# Altium project apt_battery_bms.PrjPCB (part 3 of 4)

## Sheet control_and_gauge.SchDoc
size Tabloid
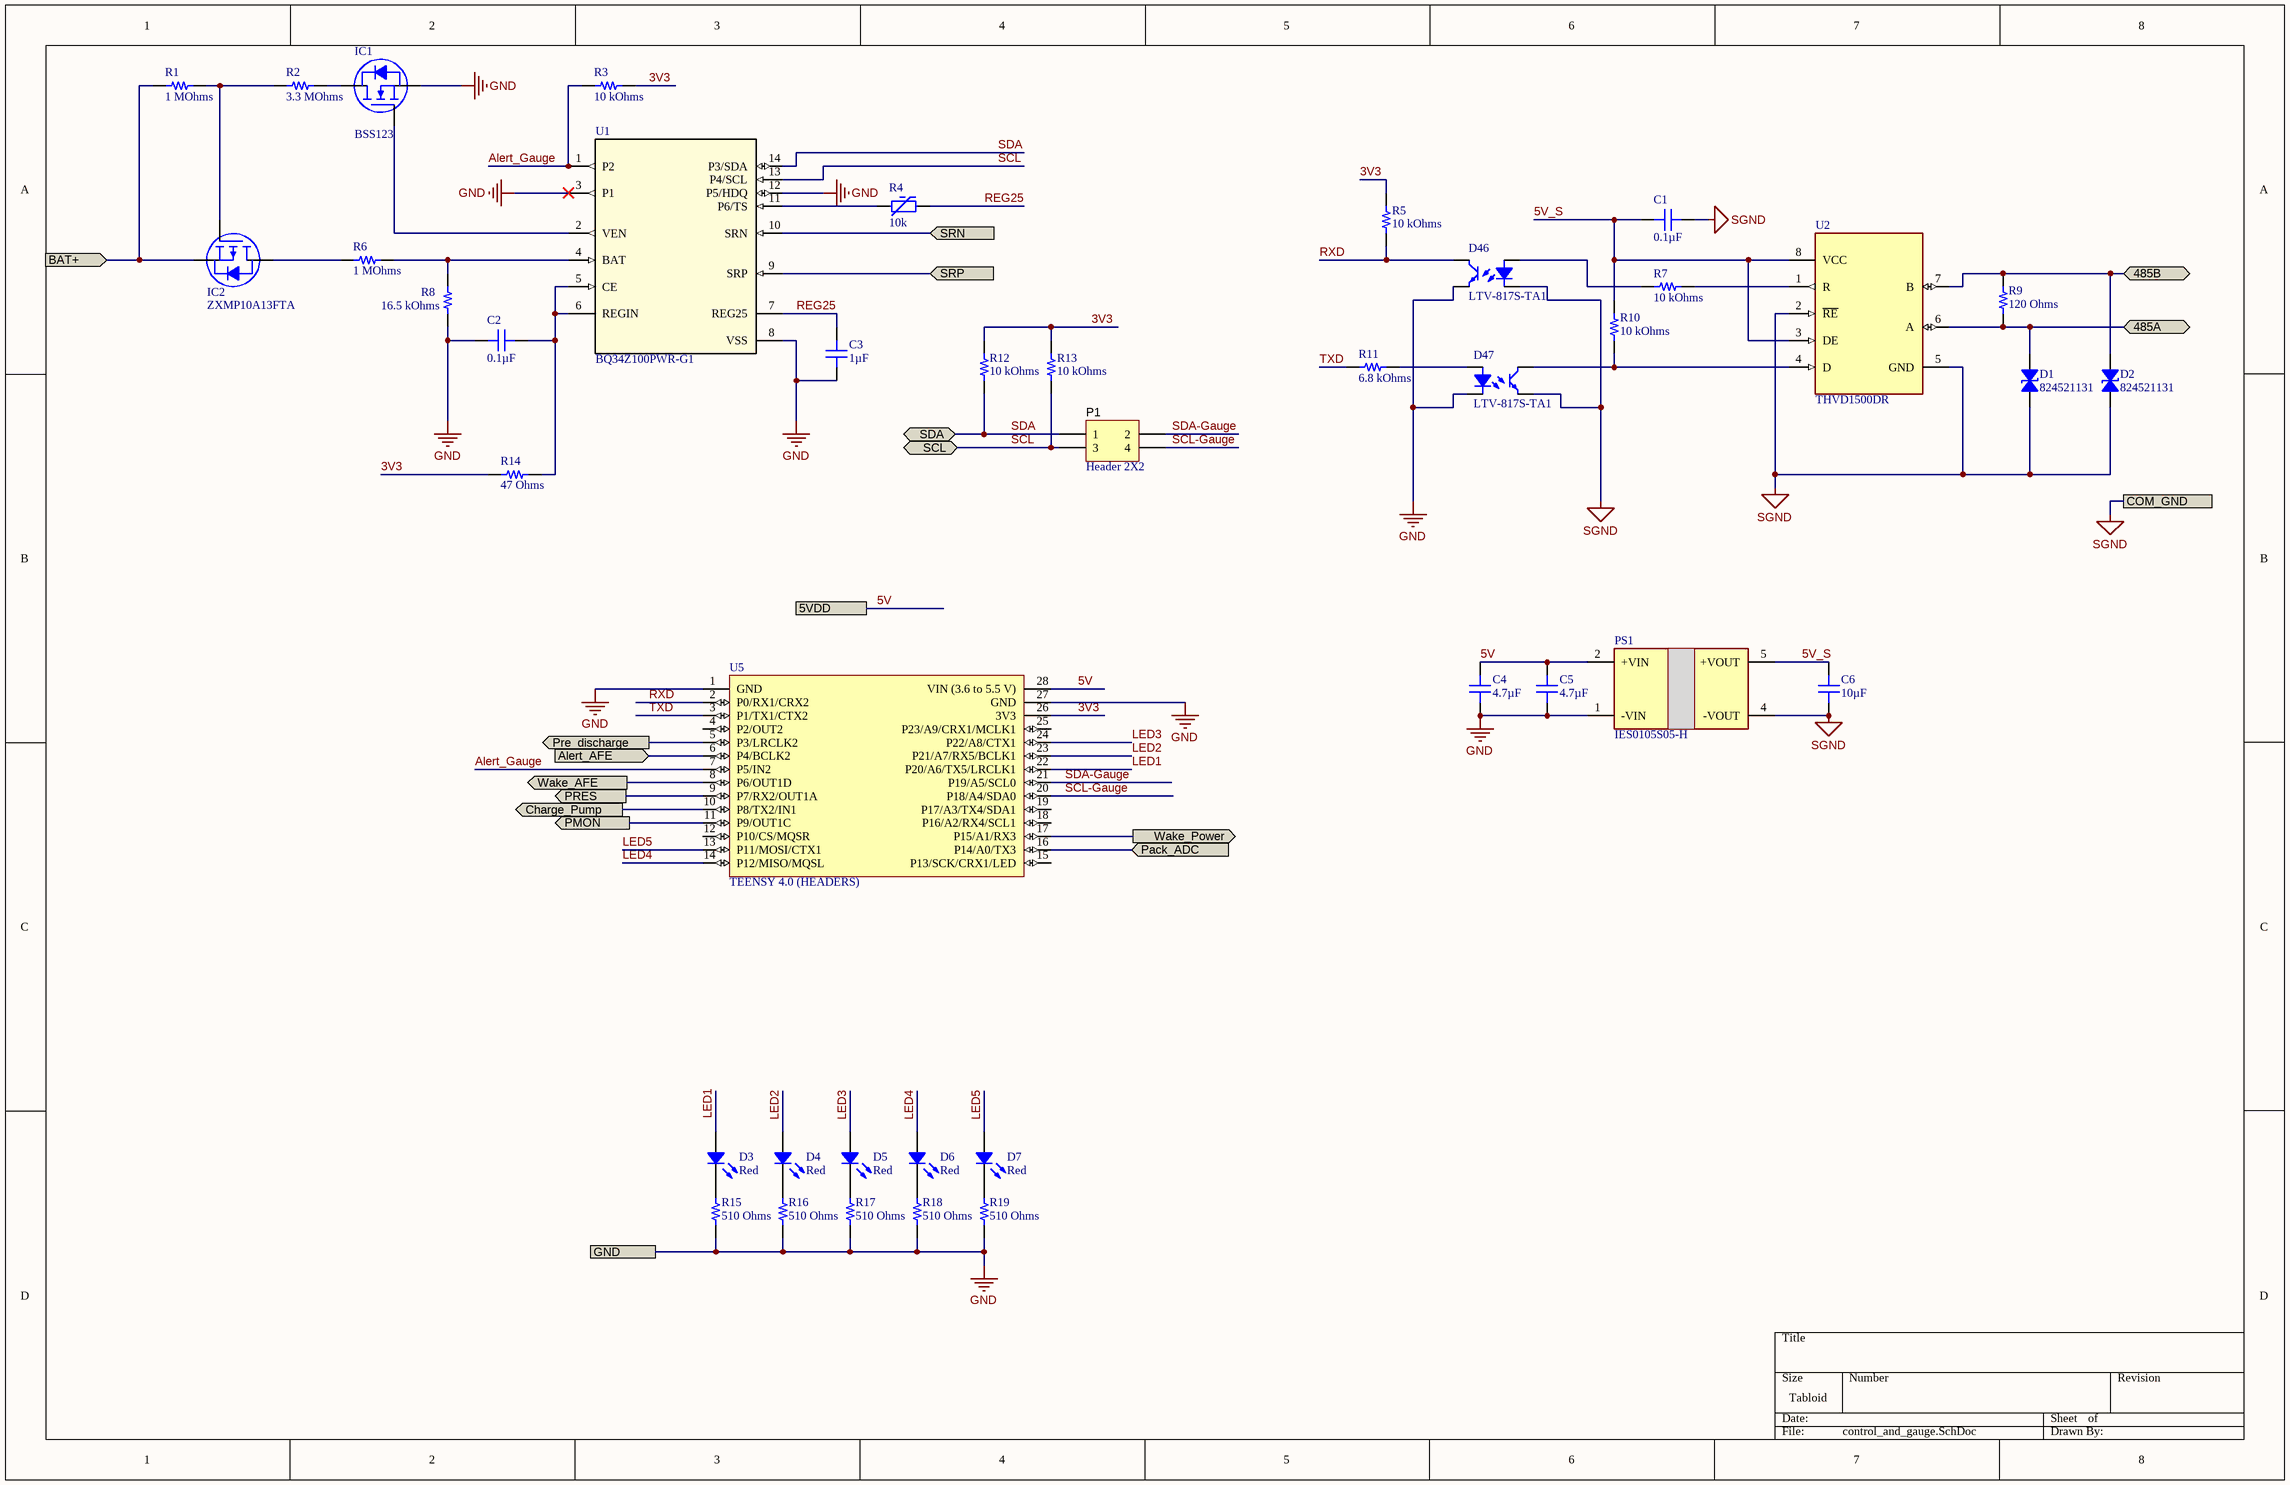
[diagram p2: control_and_gauge.SchDoc]

### Parts
C1  0.1µF  [CAP 0603_1608]
C2  0.1µF  [CAP 0603_1608]
C3  1µF  [CAP 0603_1608]
C4  4.7µF  [CAP 0805_2012]
C5  4.7µF  [CAP 0805_2012]
C6  10µF  [CAP 1210_3225 - 2.8MM]
D1  824521131  [DO214AA SMB]
D2  824521131  [DO214AA SMB]
D3  Red  [LED 0603_1608 RED]
D4  Red  [LED 0603_1608 RED]
D5  Red  [LED 0603_1608 RED]
D6  Red  [LED 0603_1608 RED]
D7  Red  [LED 0603_1608 RED]
D46  LTV-817S-TA1  [LITEON LTV-817]
D47  LTV-817S-TA1  [LITEON LTV-817]
IC1  BSS123  [ON SEMI SOT-23-3]
IC2  ZXMP10A13FTA  [DIODES SOT-23-3]
P1  Header 2X2  [HDR2X2]
PS1  IES0105S05-H  [IES0105S05H]
R1  1 MOhms  [RES 0603_1608]
R2  3.3 MOhms  [RES 0603_1608]
R3  10 kOhms  [RES 0603_1608]
R4  10k  [NTC 0603_1608]
R5  10 kOhms  [RES 0603_1608]
R6  1 MOhms  [RES 0603_1608]
R7  10 kOhms  [RES 0603_1608]
R8  16.5 kOhms  [RES 0603_1608]
R9  120 Ohms  [RES 0603_1608]
R10  10 kOhms  [RES 0603_1608]
R11  6.8 kOhms  [RES 0603_1608]
R12  10 kOhms  [RES 0603_1608]
R13  10 kOhms  [RES 0603_1608]
R14  47 Ohms  [RES 0603_1608]
R15  510 Ohms  [RES 0603_1608]
R16  510 Ohms  [RES 0603_1608]
R17  510 Ohms  [RES 0603_1608]
R18  510 Ohms  [RES 0603_1608]
R19  510 Ohms  [RES 0603_1608]
U1  BQ34Z100PWR-G1  [TSSOP_14]
U2  THVD1500DR  [SOIC_8]
U5  TEENSY 4.0 (HEADERS)  [TEENSY_SLIM]

### Ports
5VDD, 485A (bidir), 485B (bidir), Alert_AFE (in), BAT+ (in), Charge_Pump (out), COM_GND, GND, Pack_ADC (in), PMON (out), Pre_discharge (out), PRES (out), SCL (bidir), SDA (bidir), SRN (in), SRP (in), Wake_AFE (out), Wake_Power (out)

### Nets
GND: C2.1 C3.1 C4.1 C5.1 D46.3 D47.2 IC1.2(S) PS1.1(-VIN) R8.1 R15.1 R16.1 R17.1 R18.1 R19.1 U1.3(P1) U1.8(VSS) U1.12(P5/HDQ) U5.1(GND) U5.27(GND) ; port GND  [project net BAT-]
SGND: C1.1 C6.1 D1.1 D2.1 D46.2 D47.3 PS1.4(-VOUT) U2.2(~{RE}) U2.5(GND) ; port COM_GND
3V3: R3.1 R5.2 R12.1 R13.1 R14.1 U5.26(3V3)
5V: C4.2 C5.2 PS1.2(+VIN) U5.28(VIN_(3.6_to_5.5_V)) ; port 5VDD
5V_S: C1.2 C6.2 PS1.5(+VOUT) R10.2 U2.3(DE) U2.8(VCC)
430_Power: IC2.2(S) R1.2 U5.17(P15/A1/RX3) ; port BAT+, port Wake_Power
Alert_Gauge: R3.2 U1.1(P2) U5.7(P5/IN2)
LED1: D3.1 U5.22(P20/A6/TX5/LRCLK1)
LED2: D4.1 U5.23(P21/A7/RX5/BCLK1)
LED3: D5.1 U5.24(P22/A8/CTX1)
LED4: D6.1 U5.14(P12/MISO/MQSL)
LED5: D7.1 U5.13(P11/MOSI/CTX1)
REG25: C3.2 R4.1 U1.7(REG25)
RXD: D46.4 R5.1 U5.2(P0/RX1/CRX2)
SCL: P1.3 R13.2 U1.13(P4/SCL) ; port SCL
SCL-Gauge: P1.4 U5.20(P18/A4/SDA0)
SDA: P1.1 R12.2 U1.14(P3/SDA) ; port SDA
SDA-Gauge: P1.2 U5.21(P19/A5/SCL0)
TXD: R11.1 U5.3(P1/TX1/CTX2)
NetC2_2: C2.2 R14.2 U1.5(CE) U1.6(REGIN)
NetC10_2: U5.16(P14/A0/TX3) ; port Pack_ADC
NetC19_2: U5.6(P4/BCLK2) ; port Alert_AFE
NetC52_2: U1.9(SRP) ; port SRP
NetC53_2: U1.10(SRN) ; port SRN
NetD1_2: D1.2 R9.1 U2.6(A) ; port 485A
NetD2_2: D2.2 R9.2 U2.7(B) ; port 485B
NetD3_2: D3.2 R15.2
NetD4_2: D4.2 R16.2
NetD5_2: D5.2 R17.2
NetD6_2: D6.2 R18.2
NetD7_2: D7.2 R19.2
NetD46_1: D46.1 R7.2
NetD47_1: D47.1 R11.2
NetD47_4: D47.4 R10.1 U2.4(D)
NetIC1_1: IC1.1(G) U1.2(VEN)
NetIC1_3: IC1.3(D) R2.2
NetIC2_1: IC2.1(G) R1.1 R2.1
NetIC2_3: IC2.3(D) R6.2
NetIC5_1: U5.5(P3/LRCLK2) ; port Pre_discharge
NetP7_1: U5.9(P7/RX2/OUT1A) ; port PRES
NetR4_2: R4.2 U1.11(P6/TS)
NetR6_1: R6.1 R8.2 U1.4(BAT)
NetR7_1: R7.1 U2.1(R)
NetR29_1: U5.10(P8/TX2/IN1) ; port Charge_Pump
NetR35_1: U5.11(P9/OUT1C) ; port PMON
NetR109_2: U5.8(P6/OUT1D) ; port Wake_AFE

Not connected (* = marked no-connect by the designer): U5 4(P2/OUT2) 12(P10/CS/MQSR) 15(P13/SCK/CRX1/LED) 18(P16/A2/RX4/SCL1) 19(P17/A3/TX4/SDA1) 25(P23/A9/CRX1/MCLK1)

### Library data of the parts
C1 C2 = GCJ188R71H104KA12D: CAP CER 0.1UF 50V X7R 0603; Manufacturer: Murata Electronics; Tolerance: ±10%; Part Number: GCJ188R71H104KA12D; Value: 0.1µF; Applications: Automotive, Boardflex Sensitive; Capacitance: 0.1µF; ComponentLink1Description: Datasheet; ComponentLink1URL: https://www.murata.com/~/media/webrenewal/support/library/catalog/products/capacitor/mlcc/c03e.ashx?la=en-us; ComponentLink2Description: DigiKey Link; ComponentLink2URL: http://digikey.com/product-detail/en/murata-electronics/GCJ188R71H104KA12D/490-5798-1-ND/2783823; Device Package: 0603 (1608 Metric); Features: Soft Termination; LastUpdated: 9/2/2020 1:03:05 AM; Lifecycle Status: Active; Minimum Order: 1; Mounting Type: Surface Mount, MLCC; Operating Temperature: -55°C ~ 125°C; Package / Case: 0603 (1608 Metric); Packaging: TapeAndReel; PartId: 16867; Part Status: Active; Price: 0.02; Ratings: AEC-Q200; Series: GCJ; Size / Dimension: 0.063" L x 0.031" W (1.60mm x 0.80mm); Supplier 1: DigiKey; Supplier Part Number 1: 490-5798-1-ND; Temperature Coefficient: X7R; Thickness (Max): 0.035" (0.90mm); Voltage - Rated: 50V
C3 = CGA3E3X5R1H105K080AB: CAP CER 1UF 50V X5R 0603; Manufacturer: TDK Corporation; Tolerance: ±10%; Part Number: CGA3E3X5R1H105K080AB; Value: 1µF; Applications: Automotive; Capacitance: 1µF; ComponentLink1Description: Datasheet; ComponentLink1URL: https://product.tdk.com/info/en/catalog/datasheets/mlcc_automotive_general_en.pdf?ref_disty=digikey; ComponentLink2Description: DigiKey Link; ComponentLink2URL: http://digikey.com/product-detail/en/tdk-corporation/CGA3E3X5R1H105K080AB/445-7878-1-ND/2781382; Device Package: 0603 (1608 Metric); LastUpdated: 9/2/2020 1:03:17 AM; Lifecycle Status: Active; Minimum Order: 1; Mounting Type: Surface Mount, MLCC; Operating Temperature: -55°C ~ 85°C; Package / Case: 0603 (1608 Metric); Packaging: TapeAndReel; PartId: 12841; Part Status: Active; Price: 0.05; Ratings: AEC-Q200; Series: CGA; Size / Dimension: 0.063" L x 0.031" W (1.60mm x 0.80mm); Supplier 1: DigiKey; Supplier Part Number 1: 445-7878-1-ND; Temperature Coefficient: X5R; Thickness (Max): 0.035" (0.90mm); Voltage - Rated: 50V
C4 C5 = CC0805KKX7R7BB475: CAP CER 4.7UF 16V X7R 0805; Manufacturer: Yageo; Tolerance: ±10%; Part Number: CC0805KKX7R7BB475; Value: 4.7µF; Applications: General Purpose; Capacitance: 4.7µF; ComponentLink1Description: Datasheet; ComponentLink1URL: https://www.yageo.com/upload/media/product/productsearch/datasheet/mlcc/UPY-GPHC_X7R_6.3V-to-50V_18.pdf; ComponentLink2Description: DigiKey Link; ComponentLink2URL: http://digikey.com/product-detail/en/yageo/CC0805KKX7R7BB475/311-1883-1-ND/5195785; Device Package: 0805 (2012 Metric); LastUpdated: 9/2/2020 1:04:23 AM; Lifecycle Status: Active; Minimum Order: 1; Mounting Type: Surface Mount, MLCC; Operating Temperature: -55°C ~ 125°C; Package / Case: 0805 (2012 Metric); Packaging: TapeAndReel; PartId: 12987; Part Status: Active; Price: 0.09; Series: CC; Size / Dimension: 0.079" L x 0.049" W (2.00mm x 1.25mm); Supplier 1: DigiKey; Supplier Part Number 1: 311-1883-1-ND; Temperature Coefficient: X7R; Thickness (Max): 0.057" (1.45mm); Voltage - Rated: 16V
C6 = C3225X5R1H106K250AB: CAP CER 10UF 50V X5R 1210; Manufacturer: TDK Corporation; Tolerance: ±10%; Part Number: C3225X5R1H106K250AB; Value: 10µF; Applications: General Purpose; Capacitance: 10µF; ComponentLink1Description: Datasheet; ComponentLink1URL: https://product.tdk.com/info/en/catalog/datasheets/mlcc_commercial_general_en.pdf?ref_disty=digikey; ComponentLink2Description: DigiKey Link; ComponentLink2URL: http://digikey.com/product-detail/en/tdk-corporation/C3225X5R1H106K250AB/445-9074-1-ND/3648647; Device Package: 1210 (3225 Metric); Features: Low ESL; LastUpdated: 9/2/2020 1:10:51 AM; Lifecycle Status: Active; Minimum Order: 1; Mounting Type: Surface Mount, MLCC; Operating Temperature: -55°C ~ 85°C; Package / Case: 1210 (3225 Metric); Packaging: TapeAndReel; PartId: 23834; Part Status: Active; Price: 0.34; Series: C; Size / Dimension: 0.126" L x 0.098" W (3.20mm x 2.50mm); Supplier 1: DigiKey; Supplier Part Number 1: 445-9074-1-ND; Temperature Coefficient: X5R; Thickness (Max): 0.110" (2.80mm); Voltage - Rated: 50V
D1 D2 = 824521131: TVS DIODE 13V 21.5V DO214AA; Manufacturer: Würth Elektronik; Bidirectional Channels: 1; Current - Peak Pulse (10/1000µs): 28A; Power Line Protection: No; Power - Peak Pulse: 600W; Type: Zener; Voltage - Breakdown (Min): 15.15V (Typ); Voltage - Reverse Standoff (Typ): 13V (Max); Part Number: 824521131; Applications: General Purpose; ComponentLink1Description: Datasheet; ComponentLink1URL: https://katalog.we-online.de/pbs/datasheet/824521131.pdf; ComponentLink2Description: DigiKey Link; ComponentLink2URL: http://digikey.com/product-detail/en/w-rth-elektronik/824521131/732-9740-1-ND/5870894; LastUpdated: 9/2/2020 1:28:20 AM; Lifecycle Status: Active; Minimum Order: 1; Mounting Type: Surface Mount; Operating Temperature: -65°C ~ 150°C (TJ); Package / Case: DO-214AA, SMB; Packaging: TapeAndReel; PartId: 9447; Part Status: Active; Price: 0.24; Series: WE-TVSP; Supplier 1: DigiKey; Supplier Part Number 1: 732-9740-1-ND; Supplier Device Package: DO-214AA; Voltage - Clamping (Max) @ Ipp: 21.5V
D3-D7 = 150060RS75000: LED RED CLEAR 0603 SMD; Manufacturer: Würth Elektronik; Configuration: Standard; Current - Test: 20mA; Lens Color: Colorless; Lens Size: 1.10mm x 0.70mm; Lens Style: Rectangle with Flat Top; Millicandela Rating: 250mcd; Viewing Angle: 140°; Voltage - Forward (Vf) (Typ): 2V; Wavelength - Dominant: 625nm; Wavelength - Peak: 630nm; Part Number: 150060RS75000; Color: Red; ComponentLink1Description: Datasheet; ComponentLink1URL: https://katalog.we-online.de/led/datasheet/150060RS75000.pdf; ComponentLink2Description: DigiKey Link; ComponentLink2URL: http://digikey.com/product-detail/en/w-rth-elektronik/150060RS75000/732-4978-1-ND/4489899; Device Package: 0603 (1608 Metric); Height (Max): 0.80mm; LastUpdated: 9/2/2020 1:20:55 AM; Lens Transparency: Clear; Lifecycle Status: Active; Minimum Order: 1; Mounting Type: Surface Mount; Package / Case: 0603 (1608 Metric); Packaging: TapeAndReel; PartId: 490; Part Status: Active; Price: 0.10; Series: WL-SMCW; Size / Dimension: 1.60mm L x 0.80mm W; Supplier 1: DigiKey; Supplier Part Number 1: 732-4978-1-ND; Supplier Device Package: 0603; Value: Red
D46 D47 = LTV-817S-TA1: OPTOISOLATR 5KV TRANSISTOR 4-SMD; Part Number: LTV-817S-TA1
IC1 = BSS123: MOSFET N-CH 100V 170MA SOT-23; Manufacturer: ON Semiconductor; Current - Continuous Drain (Id) @ 25°C: 170mA (Ta); Drive Voltage (Max Rds On,  Min Rds On): 4.5V, 10V; FET Type: N-Channel; Gate Charge (Qg) (Max) @ Vgs: 2.5nC @ 10V; Input Capacitance (Ciss) (Max) @ Vds: 73pF @ 25V; Power Dissipation (Max): 360mW (Ta); Rds On (Max) @ Id, Vgs: 6Ohm @ 170mA, 10V; Vgs (Max): ±20V; Vgs(th) (Max) @ Id: 2V @ 1mA; Part Number: BSS123; ComponentLink1Description: Datasheet; ComponentLink1URL: https://www.onsemi.com/pub/Collateral/BSS123-D.PDF; ComponentLink2Description: DigiKey Link; ComponentLink2URL: http://digikey.com/product-detail/en/on-semiconductor/BSS123/BSS123NCT-ND/244665; Drain to Source Voltage (Vdss): 100V; LastUpdated: 9/2/2020 1:25:08 AM; Lifecycle Status: Active; Minimum Order: 1; Mounting Type: Surface Mount; Operating Temperature: -55°C ~ 150°C (TJ); Package / Case: TO-236-3, SC-59, SOT-23-3; Packaging: TapeAndReel; Part Status: Active; Price: 0.06; Series: -; Supplier 1: DigiKey; Supplier Part Number 1: BSS123NCT-ND; Supplier Device Package: SOT-23-3; Technology: MOSFET (Metal Oxide)
IC2 = ZXMP10A13FTA: MOSFET P-CH 100V 0.6A SOT23-3; Manufacturer: Diodes Incorporated; Current - Continuous Drain (Id) @ 25°C: 600mA (Ta); Drive Voltage (Max Rds On,  Min Rds On): 6V, 10V; FET Type: P-Channel; Gate Charge (Qg) (Max) @ Vgs: 3.5nC @ 10V; Input Capacitance (Ciss) (Max) @ Vds: 141pF @ 50V; Power Dissipation (Max): 625mW (Ta); Rds On (Max) @ Id, Vgs: 1Ohm @ 600mA, 10V; Vgs (Max): ±20V; Vgs(th) (Max) @ Id: 4V @ 250µA; Part Number: ZXMP10A13FTA; ComponentLink1Description: Datasheet; ComponentLink1URL: https://www.diodes.com/assets/Datasheets/ZXMP10A13F.pdf; ComponentLink2Description: DigiKey Link; ComponentLink2URL: http://digikey.com/product-detail/en/diodes-incorporated/ZXMP10A13FTA/ZXMP10A13FCT-ND/560670; Drain to Source Voltage (Vdss): 100V; LastUpdated: 9/2/2020 1:25:04 AM; Lifecycle Status: Active; Minimum Order: 1; Mounting Type: Surface Mount; Operating Temperature: -55°C ~ 150°C (TJ); Package / Case: TO-236-3, SC-59, SOT-23-3; Packaging: TapeAndReel; Part Status: Active; Price: 0.20; Series: -; Supplier 1: DigiKey; Supplier Part Number 1: ZXMP10A13FCT-ND; Supplier Device Package: SOT-23-3; Technology: MOSFET (Metal Oxide)
P1 = Header 2X2: Header, 2-Pin, Dual row; LatestRevisionDate: 17-Jul-2002; LatestRevisionNote: Re-released for DXP Platform.; Publisher: Altium Limited
PS1 = IES0105S05-H: Isolated DC/DC Converters DC-DC, 1W, Unregulated, SMD, HIGH ISOLATION; Manufacturer: XP Power; Datasheet Link: https://www.mouser.com/datasheet/2/942/SF_IES01-1666999.pdf; Height: 7.35mm; Mouser Part Number: 209-IES0105S05-H; Mouser Price/Stock: https://www.mouser.co.uk/ProductDetail/XP-Power/IES0105S05-H?qs=Cb2nCFKsA8q04%252BaEkllcdA%3D%3D; Supplier 1: Mouser; Manufacturer Part Number: IES0105S05-H; Stock 1: 83; Pricing 1: 1=3.4, 5=3.3, 10=3.2, 25=3.06, 50=3.06, 100=2.85 (USD); Supplier 2: Digi-Key; Stock 2: 150; Pricing 2: 1=3.4, 5=3.298, 10=3.196, 25=3.06, 100=2.856 (USD); ComponentLink1Description: https://www.mouser.com/datasheet/2/942/SF_IES01-1666999.pdf; ComponentLink1URL: https://www.mouser.com/datasheet/2/942/SF_IES01-1666999.pdf; Supplier Part Number 1: 209-IES0105S05-H; Supplier Part Number 2: 1470-IES0105S05-H-ND
R1 R6 = CRCW06031M00FKEA: RES SMD 1M OHM 1% 1/10W 0603; Manufacturer: Vishay Dale; Power (Watts): 0.1W, 1/10W; Temperature Coefficient: ±100ppm/°C; Part Number: CRCW06031M00FKEA; Value: 1 MOhms; ComponentLink1Description: Datasheet; ComponentLink1URL: http://www.vishay.com/docs/20035/dcrcwe3.pdf; ComponentLink2Description: DigiKey Link; ComponentLink2URL: http://digikey.com/product-detail/en/vishay-dale/CRCW06031M00FKEA/541-1.00MHCT-ND/1180152; Composition: Thick Film; Device Package: 0603 (1608 Metric); Features: Automotive AEC-Q200; Height - Seated (Max): 0.020" (0.50mm); LastUpdated: 9/2/2020 1:10:09 AM; Lifecycle Status: Active; Minimum Order: 1; Number of Terminations: 2; Operating Temperature: -55°C ~ 155°C; Package / Case: 0603 (1608 Metric); Packaging: CutTape; PartId: 12567; Part Status: Active; Price: 0.10; Ratings: AEC-Q200; Resistance: 1 MOhms; Series: CRCW; Size / Dimension: 0.061" L x 0.033" W (1.55mm x 0.85mm); Supplier 1: DigiKey; Supplier Part Number 1: 541-1.00MHCT-ND; Supplier Device Package: 0603; Tolerance: ±1%
R2 = CRCW06033M30FKEA: RES SMD 3.3M OHM 1% 1/10W 0603; Manufacturer: Vishay Dale; Power (Watts): 0.1W, 1/10W; Temperature Coefficient: ±100ppm/°C; Part Number: CRCW06033M30FKEA; Value: 3.3 MOhms; ComponentLink1Description: Datasheet; ComponentLink1URL: http://www.vishay.com/docs/20035/dcrcwe3.pdf; ComponentLink2Description: DigiKey Link; ComponentLink2URL: http://digikey.com/product-detail/en/vishay-dale/CRCW06033M30FKEA/541-3.30MHCT-ND/1180209; Composition: Thick Film; Device Package: 0603 (1608 Metric); Features: Automotive AEC-Q200; Height - Seated (Max): 0.020" (0.50mm); LastUpdated: 9/2/2020 1:09:32 AM; Lifecycle Status: Active; Minimum Order: 1; Number of Terminations: 2; Operating Temperature: -55°C ~ 155°C; Package / Case: 0603 (1608 Metric); Packaging: CutTape; PartId: 25411; Part Status: Active; Price: 0.10; Ratings: AEC-Q200; Resistance: 3.3 MOhms; Series: CRCW; Size / Dimension: 0.061" L x 0.033" W (1.55mm x 0.85mm); Supplier 1: DigiKey; Supplier Part Number 1: 541-3.30MHCT-ND; Supplier Device Package: 0603; Tolerance: ±1%
R3 R5 R7 R10 R12 R13 = CRCW060310K0FKEA: RES SMD 10K OHM 1% 1/10W 0603; Manufacturer: Vishay Dale; Power (Watts): 0.1W, 1/10W; Temperature Coefficient: ±100ppm/°C; Part Number: CRCW060310K0FKEA; Value: 10 kOhms; ComponentLink1Description: Datasheet; ComponentLink1URL: http://www.vishay.com/docs/20035/dcrcwe3.pdf; ComponentLink2Description: DigiKey Link; ComponentLink2URL: http://digikey.com/product-detail/en/vishay-dale/CRCW060310K0FKEA/541-10.0KHCT-ND/1179924; Composition: Thick Film; Device Package: 0603 (1608 Metric); Features: Automotive AEC-Q200; Height - Seated (Max): 0.020" (0.50mm); LastUpdated: 9/2/2020 1:09:36 AM; Lifecycle Status: Active; Minimum Order: 1; Number of Terminations: 2; Operating Temperature: -55°C ~ 155°C; Package / Case: 0603 (1608 Metric); Packaging: CutTape; PartId: 24636; Part Status: Active; Price: 0.10; Ratings: AEC-Q200; Resistance: 10 kOhms; Series: CRCW; Size / Dimension: 0.061" L x 0.033" W (1.55mm x 0.85mm); Supplier 1: DigiKey; Supplier Part Number 1: 541-10.0KHCT-ND; Supplier Device Package: 0603; Tolerance: ±1%
R4 = NTCS0603E3103FMT: THERMISTOR NTC 10KOHM 3610K 0603; Manufacturer: Vishay BC Components; B Value Tolerance: ±1%; Power - Max: 125mW; Part Number: NTCS0603E3103FMT; B25/85: 3610K; ComponentLink1Description: Datasheet; ComponentLink1URL: http://www.vishay.com/docs/29056/ntcs0603e3t.pdf; ComponentLink2Description: DigiKey Link; ComponentLink2URL: http://digikey.com/product-detail/en/vishay-bc-components/NTCS0603E3103FMT/BC2472CT-ND/2230853; Device Package: 0603 (1608 Metric); LastUpdated: 9/2/2020 1:22:38 AM; Lifecycle Status: Active; Minimum Order: 1; Mounting Type: Surface Mount; Operating Temperature: -40°C ~ 150°C; Package / Case: 0603 (1608 Metric); Packaging: TapeAndReel; PartId: 450; Part Status: Active; Price: 0.38; Resistance in Ohms @ 25°C: 10k; Resistance Tolerance: ±1%; Series: Automotive, AEC-Q200; Supplier 1: DigiKey; Supplier Part Number 1: BC2472CT-ND; Value: 10k
R8 = CRCW060316K5FKEA: RES SMD 16.5K OHM 1% 1/10W 0603; Manufacturer: Vishay Dale; Power (Watts): 0.1W, 1/10W; Temperature Coefficient: ±100ppm/°C; Part Number: CRCW060316K5FKEA; Value: 16.5 kOhms; ComponentLink1Description: Datasheet; ComponentLink1URL: http://www.vishay.com/docs/20035/dcrcwe3.pdf; ComponentLink2Description: DigiKey Link; ComponentLink2URL: http://digikey.com/product-detail/en/vishay-dale/CRCW060316K5FKEA/541-16.5KHCT-ND/1179947; Composition: Thick Film; Device Package: 0603 (1608 Metric); Features: Automotive AEC-Q200; Height - Seated (Max): 0.020" (0.50mm); LastUpdated: 9/2/2020 1:09:44 AM; Lifecycle Status: Active; Minimum Order: 1; Number of Terminations: 2; Operating Temperature: -55°C ~ 155°C; Package / Case: 0603 (1608 Metric); Packaging: CutTape; PartId: 22960; Part Status: Active; Price: 0.10; Ratings: AEC-Q200; Resistance: 16.5 kOhms; Series: CRCW; Size / Dimension: 0.061" L x 0.033" W (1.55mm x 0.85mm); Supplier 1: DigiKey; Supplier Part Number 1: 541-16.5KHCT-ND; Supplier Device Package: 0603; Tolerance: ±1%
R9 = CRCW0603120RFKEA: RES SMD 120 OHM 1% 1/10W 0603; Manufacturer: Vishay Dale; Power (Watts): 0.1W, 1/10W; Temperature Coefficient: ±100ppm/°C; Part Number: CRCW0603120RFKEA; Value: 120 Ohms; ComponentLink1Description: Datasheet; ComponentLink1URL: http://www.vishay.com/docs/20035/dcrcwe3.pdf; ComponentLink2Description: DigiKey Link; ComponentLink2URL: http://digikey.com/product-detail/en/vishay-dale/CRCW0603120RFKEA/541-120HCT-ND/1179703; Composition: Thick Film; Device Package: 0603 (1608 Metric); Features: Automotive AEC-Q200; Height - Seated (Max): 0.020" (0.50mm); LastUpdated: 9/2/2020 1:10:08 AM; Lifecycle Status: Active; Minimum Order: 1; Number of Terminations: 2; Operating Temperature: -55°C ~ 155°C; Package / Case: 0603 (1608 Metric); Packaging: CutTape; PartId: 12619; Part Status: Active; Price: 0.10; Ratings: AEC-Q200; Resistance: 120 Ohms; Series: CRCW; Size / Dimension: 0.061" L x 0.033" W (1.55mm x 0.85mm); Supplier 1: DigiKey; Supplier Part Number 1: 541-120HCT-ND; Supplier Device Package: 0603; Tolerance: ±1%
R11 = CRCW06036K80FKEA: RES SMD 6.8K OHM 1% 1/10W 0603; Manufacturer: Vishay Dale; Power (Watts): 0.1W, 1/10W; Temperature Coefficient: ±100ppm/°C; Part Number: CRCW06036K80FKEA; Value: 6.8 kOhms; ComponentLink1Description: Datasheet; ComponentLink1URL: http://www.vishay.com/docs/20035/dcrcwe3.pdf; ComponentLink2Description: DigiKey Link; ComponentLink2URL: http://digikey.com/product-detail/en/vishay-dale/CRCW06036K80FKEA/541-6.80KHCT-ND/1179904; Composition: Thick Film; Device Package: 0603 (1608 Metric); Features: Automotive AEC-Q200; Height - Seated (Max): 0.020" (0.50mm); LastUpdated: 9/2/2020 1:10:08 AM; Lifecycle Status: Active; Minimum Order: 1; Number of Terminations: 2; Operating Temperature: -55°C ~ 155°C; Package / Case: 0603 (1608 Metric); Packaging: CutTape; PartId: 12650; Part Status: Active; Price: 0.10; Ratings: AEC-Q200; Resistance: 6.8 kOhms; Series: CRCW; Size / Dimension: 0.061" L x 0.033" W (1.55mm x 0.85mm); Supplier 1: DigiKey; Supplier Part Number 1: 541-6.80KHCT-ND; Supplier Device Package: 0603; Tolerance: ±1%
R14 = CRCW060347R0FKEA: RES SMD 47 OHM 1% 1/10W 0603; Manufacturer: Vishay Dale; Power (Watts): 0.1W, 1/10W; Temperature Coefficient: ±100ppm/°C; Part Number: CRCW060347R0FKEA; Value: 47 Ohms; ComponentLink1Description: Datasheet; ComponentLink1URL: http://www.vishay.com/docs/20035/dcrcwe3.pdf; ComponentLink2Description: DigiKey Link; ComponentLink2URL: http://digikey.com/product-detail/en/vishay-dale/CRCW060347R0FKEA/541-47.0HCT-ND/1179657; Composition: Thick Film; Device Package: 0603 (1608 Metric); Features: Automotive AEC-Q200; Height - Seated (Max): 0.020" (0.50mm); LastUpdated: 9/2/2020 1:10:02 AM; Lifecycle Status: Active; Minimum Order: 1; Number of Terminations: 2; Operating Temperature: -55°C ~ 155°C; Package / Case: 0603 (1608 Metric); Packaging: CutTape; PartId: 15336; Part Status: Active; Price: 0.10; Ratings: AEC-Q200; Resistance: 47 Ohms; Series: CRCW; Size / Dimension: 0.061" L x 0.033" W (1.55mm x 0.85mm); Supplier 1: DigiKey; Supplier Part Number 1: 541-47.0HCT-ND; Supplier Device Package: 0603; Tolerance: ±1%
R15-R19 = CRCW0603510RFKEA: RES SMD 510 OHM 1% 1/10W 0603; Manufacturer: Vishay Dale; Power (Watts): 0.1W, 1/10W; Temperature Coefficient: ±100ppm/°C; Part Number: CRCW0603510RFKEA; Value: 510 Ohms; ComponentLink1Description: Datasheet; ComponentLink1URL: http://www.vishay.com/docs/20035/dcrcwe3.pdf; ComponentLink2Description: DigiKey Link; ComponentLink2URL: http://digikey.com/product-detail/en/vishay-dale/CRCW0603510RFKEA/541-510HCT-ND/1179775; Composition: Thick Film; Device Package: 0603 (1608 Metric); Features: Automotive AEC-Q200; Height - Seated (Max): 0.020" (0.50mm); LastUpdated: 9/2/2020 1:10:08 AM; Lifecycle Status: Active; Minimum Order: 1; Number of Terminations: 2; Operating Temperature: -55°C ~ 155°C; Package / Case: 0603 (1608 Metric); Packaging: CutTape; PartId: 12640; Part Status: Active; Price: 0.10; Ratings: AEC-Q200; Resistance: 510 Ohms; Series: CRCW; Size / Dimension: 0.061" L x 0.033" W (1.55mm x 0.85mm); Supplier 1: DigiKey; Supplier Part Number 1: 541-510HCT-ND; Supplier Device Package: 0603; Tolerance: ±1%
U1 = BQ34Z100PWR-G1: No Description Available; SourceLibrary: TI_2016-05-20; Built_By: EMA_UL_Team; Vendor: Texas Instruments; Interface: I2C; Operating Supply Voltage: 4.5V; Copyright: Copyright (C) 2018 Accelerated Designs. All rights reserved; RefDes: RefDes; Type: DEV; Supplier 1: Mouser; Manufacturer: Texas Instruments; Manufacturer Part Number: BQ34Z100PWR-G1; Stock 1: 10681; Pricing 1: 1=4.09, 10=3.67, 25=3.47, 100=2.85, 250=2.56, 500=2.47, 1000=2.05, 2000=1.98, 4000=1.91 (USD); Mount: Surface Mount; Case/Package: TSSOP; Number of Pins: 14; Weight: 0.004949oz; Contact Plating: Gold; Min Operating Temperature: -40°C; Max Operating Temperature: 85°C; Packaging: Tape and Reel; Package Quantity: 2000; Lead Free: Lead Free; Supplier Part Number 1: 595-BQ34Z100PWR-G1; ComponentLink1Description: datasheet; ComponentLink1URL: https://www.ti.com/lit/ds/symlink/bq34z100-g1.pdf?HQS=TI-null-null-digikeymode-df-pf-null-wwe&ts=1601757828948
U2 = THVD1500DR: 1/1 Transceiver Half RS485 8-SOIC; Manufacturer: Texas Instruments; Simplex/Duplex: Half Duplex; Receiver Hysteresis: 50mV; Data Rate: 300Kbps; Datasheet Link: http://www.ti.com/lit/ds/symlink/thvd1500.pdf; Height: 1.75mm; Arrow Part Number: THVD1500DR; Arrow Price/Stock: https://www.arrow.com/en/products/thvd1500dr/texas-instruments; Mouser Part Number: 595-THVD1500DR; Mouser Price/Stock: https://www.mouser.co.uk/ProductDetail/Texas-Instruments/THVD1500DR?qs=BZBei1rCqCCoy%2F6ZamlIPw%3D%3D; Supplier 1: Digi-Key; Manufacturer Part Number: THVD1500DR; Stock 1: 9835; Pricing 1: 1=1.29, 10=1.151, 25=1.092, 100=0.8385, 250=0.741, 500=0.702, 1000=0.546 (USD); Mount: Surface Mount; Case/Package: SOIC; Number of Pins: 8; Min Operating Temperature: -40°C; Max Operating Temperature: 125°C; Packaging: Cut Tape; ComponentLink1URL: http://www.ti.com/lit/ds/symlink/thvd1500.pdf?src-supplier=Digi-Key; ComponentLink1Description: http://www.ti.com/lit/ds/symlink/thvd1500.pdf?src-supplier=Digi-Key; Supplier Part Number 1: 296-48170-6-ND
U5 = TEENSY_4.0: RT1062 Teensy 4.0 series ARM® Cortex®-M7 MCU 32-Bit Embedded Evaluation Board; ComponentLink1Description: https://www.pjrc.com/store/teensy40.html; ComponentLink1URL: https://www.pjrc.com/store/teensy40.html

## Sheet fet_driver.SchDoc
size Tabloid
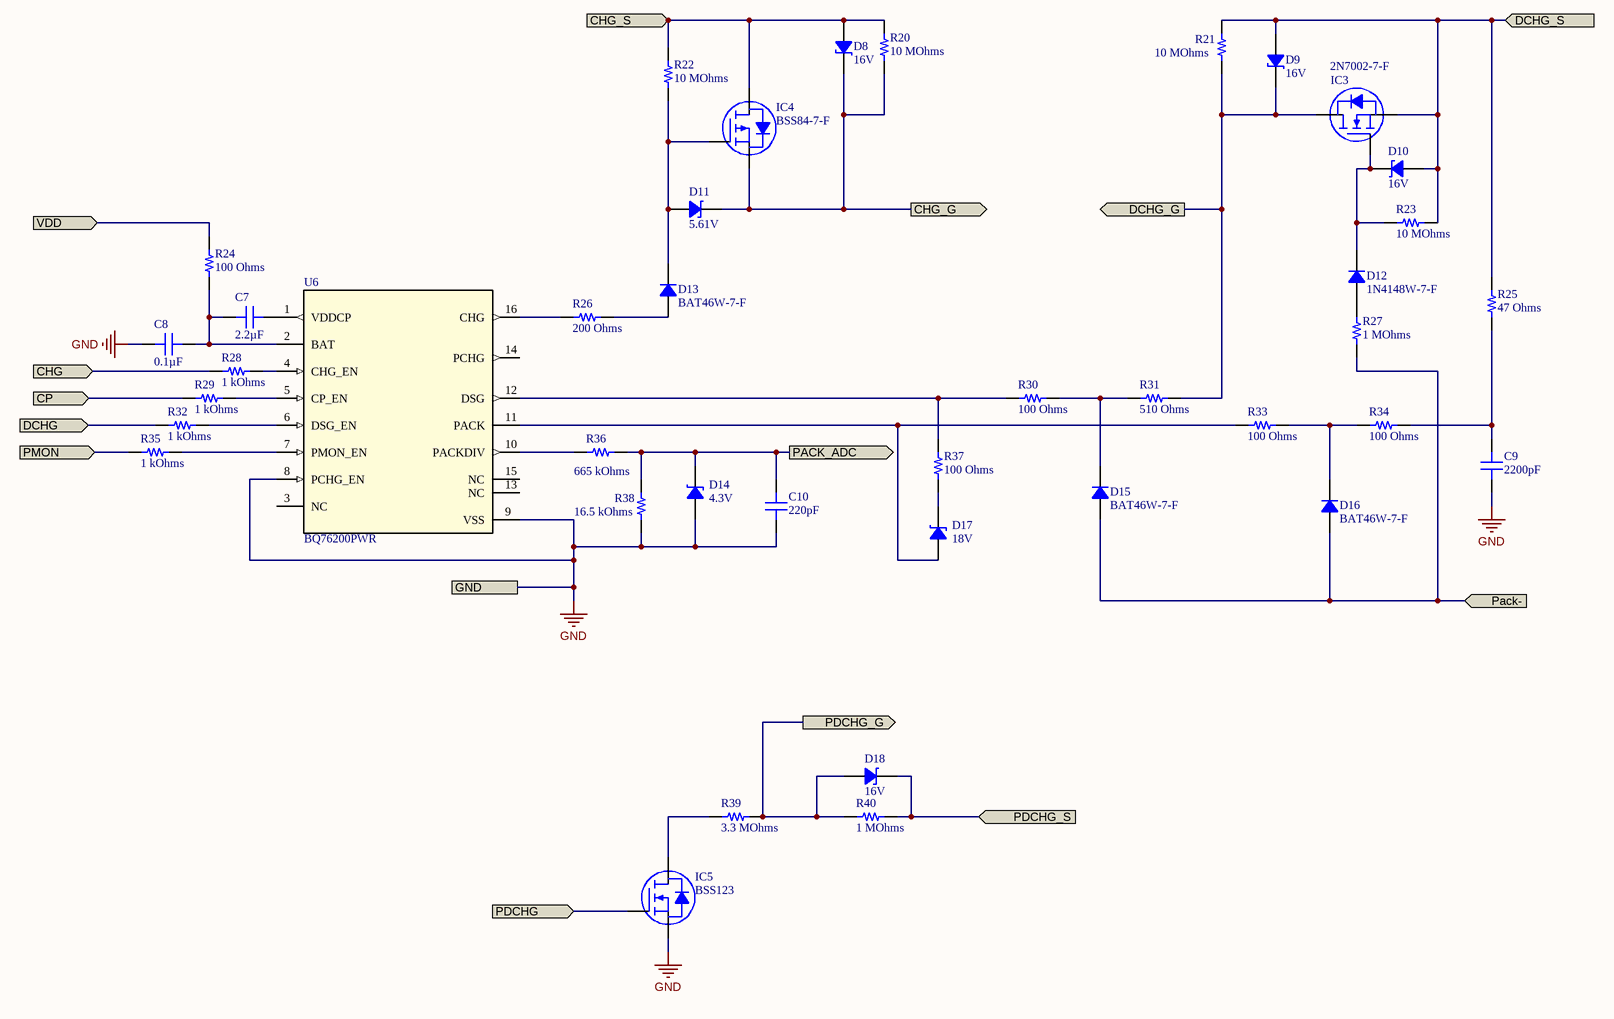
[diagram p3: fet_driver.SchDoc]

### Parts
C7  2.2µF  [CAP 1210_3225 - 2.5MM]
C8  0.1µF  [CAP 0603_1608]
C9  2200pF  [CAP 0603_1608]
C10  220pF  [CAP 0603_1608]
D8  Voltage - Zener (Nom) (Vz): 16V  [SOD-123]  (hidden comment: MMSZ5246B-7-F)
D9  Voltage - Zener (Nom) (Vz): 16V  [SOD-123]  (hidden comment: MMSZ5246B-7-F)
D10  Voltage - Zener (Nom) (Vz): 16V  [SOD-123]  (hidden comment: MMSZ5246B-7-F)
D11  Voltage - Zener (Nom) (Vz): 5.61V  [SOD523F]  (hidden comment: MM5Z5V6ST1G)
D12  1N4148W-7-F  [SOD-123]
D13  BAT46W-7-F  [SOD-123]
D14  Voltage - Zener (Nom) (Vz): 4.3V  [SOD-123]  (hidden comment: MMSZ5229BT1G)
D15  BAT46W-7-F  [SOD-123]
D16  BAT46W-7-F  [SOD-123]
D17  Voltage - Zener (Nom) (Vz): 18V  [DIODES SOT-523]  (hidden comment: MMBZ5248BT-7-F)
D18  Voltage - Zener (Nom) (Vz): 16V  [SOD-123]  (hidden comment: MMSZ5246B-7-F)
IC3  2N7002-7-F  [DIODES SOT-23-3]
IC4  BSS84-7-F  [DIODES SOT-23-3]
IC5  BSS123  [ON SEMI SOT-23-3]
R20  10 MOhms  [RES 0603_1608]
R21  10 MOhms  [RES 0603_1608]
R22  10 MOhms  [RES 0603_1608]
R23  10 MOhms  [RES 0603_1608]
R24  100 Ohms  [RES 0603_1608]
R25  47 Ohms  [RES 0603_1608]
R26  200 Ohms  [RES 0603_1608]
R27  1 MOhms  [RES 0603_1608]
R28  1 kOhms  [RES 0603_1608]
R29  1 kOhms  [RES 0603_1608]
R30  100 Ohms  [RES 0603_1608]
R31  510 Ohms  [RES 0603_1608]
R32  1 kOhms  [RES 0603_1608]
R33  100 Ohms  [RES 0603_1608]
R34  100 Ohms  [RES 0603_1608]
R35  1 kOhms  [RES 0603_1608]
R36  665 kOhms  [RES 0603_1608]
R37  100 Ohms  [RES 0603_1608]
R38  16.5 kOhms  [RES 0603_1608]
R39  3.3 MOhms  [RES 0603_1608]
R40  1 MOhms  [RES 0603_1608]
U6  BQ76200PWR  [TSSOP_16]

### Ports
CHG (in), CHG_G (out), CHG_S (in), CP (in), DCHG (in), DCHG_G (out), DCHG_S (in), GND, Pack- (in), PACK_ADC (out), PDCHG (in), PDCHG_G (out), PDCHG_S (in), PMON (in), VDD (in)

### Nets
GND: C8.1 C9.1 C10.1 D14.1 IC5.2(S) R38.1 U6.8(PCHG_EN) U6.9(VSS) ; port GND  [project net BAT-]
Pack+: D9.1 D10.1 IC3.2(S) R21.2 R23.1 R25.2 ; port DCHG_S
Pack-: D15.1 D16.1 R27.1 ; port Pack-
NetC7_1: C7.1 C8.2 R24.1 U6.2(BAT)
NetC7_2: C7.2 U6.1(VDDCP)
NetC9_2: C9.2 R25.1 R34.1
NetC10_2: C10.2 D14.2 R36.2 R38.2 ; port PACK_ADC
NetC41_2: D8.1 IC4.3(D) R20.2 R22.2 ; port CHG_S
NetC44_2: R24.2 ; port VDD
NetD8_2: D8.2 D11.2 IC4.2(S) R20.1 ; port CHG_G
NetD9_2: D9.2 IC3.3(D) R21.1 R31.2 ; port DCHG_G
NetD10_2: D10.2 D12.2 IC3.1(G) R23.2
NetD11_1: D11.1 D13.2 IC4.1(G) R22.1
NetD12_1: D12.1 R27.2
NetD13_1: D13.1 R26.2
NetD15_2: D15.2 R30.1 R31.1
NetD16_2: D16.2 R33.1 R34.2
NetD17_1: D17.1 R33.2 U6.11(PACK)
NetD17_2: D17.2 R37.2
NetD18_1: D18.1 R39.2 R40.2 ; port PDCHG_G
NetD18_2: D18.2 R40.1 ; port PDCHG_S
NetIC5_1: IC5.1(G) ; port PDCHG
NetIC5_3: IC5.3(D) R39.1
NetR26_1: R26.1 U6.16(CHG)
NetR28_1: R28.1 ; port CHG
NetR28_2: R28.2 U6.4(CHG_EN)
NetR29_1: R29.1 ; port CP
NetR29_2: R29.2 U6.5(CP_EN)
NetR30_2: R30.2 R37.1 U6.12(DSG)
NetR32_1: R32.1 ; port DCHG
NetR32_2: R32.2 U6.6(DSG_EN)
NetR35_1: R35.1 ; port PMON
NetR35_2: R35.2 U6.7(PMON_EN)
NetR36_1: R36.1 U6.10(PACKDIV)

Not connected (* = marked no-connect by the designer): U6 3(NC) 13(NC) 14(PCHG) 15(NC)

### Library data of the parts
C7 = C3225X7R2A225K230AE: CAP CER 2.2UF 100V X7R 1210; Manufacturer: TDK Corporation; Tolerance: ±10%; Part Number: C3225X7R2A225K230AE; Value: 2.2µF; Applications: Boardflex Sensitive; Capacitance: 2.2µF; ComponentLink1Description: Datasheet; ComponentLink1URL: https://product.tdk.com/info/en/catalog/datasheets/mlcc_commercial_soft_en.pdf?ref_disty=digikey; ComponentLink2Description: DigiKey Link; ComponentLink2URL: http://digikey.com/product-detail/en/tdk-corporation/C3225X7R2A225K230AE/445-8913-1-ND/3283757; Device Package: 1210 (3225 Metric); Features: Soft Termination; LastUpdated: 9/2/2020 1:10:44 AM; Lifecycle Status: Active; Minimum Order: 1; Mounting Type: Surface Mount, MLCC; Operating Temperature: -55°C ~ 125°C; Package / Case: 1210 (3225 Metric); Packaging: TapeAndReel; PartId: 24320; Part Status: Active; Price: 0.39; Series: C; Size / Dimension: 0.126" L x 0.098" W (3.20mm x 2.50mm); Supplier 1: DigiKey; Supplier Part Number 1: 445-8913-1-ND; Temperature Coefficient: X7R; Thickness (Max): 0.098" (2.50mm); Voltage - Rated: 100V
C8 = GCJ188R72A104KA01D: CAP CER 0.1UF 100V X7R 0603; Manufacturer: Murata Electronics; Tolerance: ±10%; Part Number: GCJ188R72A104KA01D; Value: 0.1µF; Applications: Automotive, Boardflex Sensitive; Capacitance: 0.1µF; ComponentLink1Description: Datasheet; ComponentLink1URL: https://www.murata.com/~/media/webrenewal/support/library/catalog/products/capacitor/mlcc/c03e.ashx?la=en-us; ComponentLink2Description: DigiKey Link; ComponentLink2URL: http://digikey.com/product-detail/en/murata-electronics/GCJ188R72A104KA01D/490-13420-1-ND/6012292; Device Package: 0603 (1608 Metric); Features: Soft Termination; LastUpdated: 9/2/2020 1:03:01 AM; Lifecycle Status: Active; Minimum Order: 1; Mounting Type: Surface Mount, MLCC; Operating Temperature: -55°C ~ 125°C; Package / Case: 0603 (1608 Metric); Packaging: TapeAndReel; PartId: 17976; Part Status: Active; Price: 0.05; Ratings: AEC-Q200; Series: GCJ; Size / Dimension: 0.063" L x 0.031" W (1.60mm x 0.80mm); Supplier 1: DigiKey; Supplier Part Number 1: 490-13420-1-ND; Temperature Coefficient: X7R; Thickness (Max): 0.035" (0.90mm); Voltage - Rated: 100V
C9 = CGA3E2X7R2A222K080AE: CAP CER 2200PF 100V X7R 0603; Manufacturer: TDK Corporation; Tolerance: ±10%; Part Number: CGA3E2X7R2A222K080AE; Value: 2200pF; Applications: Automotive, Boardflex Sensitive; Capacitance: 2200pF; ComponentLink1Description: Datasheet; ComponentLink1URL: https://product.tdk.com/info/en/catalog/datasheets/mlcc_automotive_soft_en.pdf?ref_disty=digikey; ComponentLink2Description: DigiKey Link; ComponentLink2URL: http://digikey.com/product-detail/en/tdk-corporation/CGA3E2X7R2A222K080AE/445-173761-1-ND/5809832; Device Package: 0603 (1608 Metric); Features: Soft Termination; LastUpdated: 9/2/2020 1:03:11 AM; Lifecycle Status: Active; Minimum Order: 1; Mounting Type: Surface Mount, MLCC; Operating Temperature: -55°C ~ 125°C; Package / Case: 0603 (1608 Metric); Packaging: TapeAndReel; PartId: 14930; Part Status: Active; Price: 0.03; Ratings: AEC-Q200; Series: CGA; Size / Dimension: 0.063" L x 0.031" W (1.60mm x 0.80mm); Supplier 1: DigiKey; Supplier Part Number 1: 445-173761-1-ND; Temperature Coefficient: X7R; Thickness (Max): 0.037" (0.95mm); Voltage - Rated: 100V
C10 = CC0603KRX7R9BB221: CAP CER 220PF 50V X7R 0603; Manufacturer: Yageo; Tolerance: ±10%; Part Number: CC0603KRX7R9BB221; Value: 220pF; Applications: General Purpose; Capacitance: 220pF; ComponentLink1Description: Datasheet; ComponentLink1URL: https://www.yageo.com/upload/media/product/productsearch/datasheet/mlcc/UPY-GPHC_X7R_6.3V-to-50V_18.pdf; ComponentLink2Description: DigiKey Link; ComponentLink2URL: http://digikey.com/product-detail/en/yageo/CC0603KRX7R9BB221/311-1077-1-ND/302987; Device Package: 0603 (1608 Metric); LastUpdated: 9/2/2020 1:03:05 AM; Lifecycle Status: Active; Minimum Order: 1; Mounting Type: Surface Mount, MLCC; Operating Temperature: -55°C ~ 125°C; Package / Case: 0603 (1608 Metric); Packaging: TapeAndReel; PartId: 16734; Part Status: Active; Price: 0.01; Series: CC; Size / Dimension: 0.063" L x 0.031" W (1.60mm x 0.80mm); Supplier 1: DigiKey; Supplier Part Number 1: 311-1077-1-ND; Temperature Coefficient: X7R; Thickness (Max): 0.035" (0.90mm); Voltage - Rated: 50V
D8-D10 D18 = MMSZ5246B-7-F: DIODE ZENER 16V 500MW SOD123; Manufacturer: Diodes Incorporated; Current - Reverse Leakage @ Vr: 100nA @ 12V; Impedance (Max) (Zzt): 17 Ohms; Tolerance: ±5%; Voltage - Forward (Vf) (Max) @ If: 900mV @ 10mA; Part Number: MMSZ5246B-7-F; ComponentLink1Description: Datasheet; ComponentLink1URL: https://www.diodes.com/assets/Datasheets/ds18010.pdf; ComponentLink2Description: DigiKey Link; ComponentLink2URL: http://digikey.com/product-detail/en/diodes-incorporated/MMSZ5246B-7-F/MMSZ5246B-FDICT-ND/717912; LastUpdated: 9/2/2020 1:19:27 AM; Lifecycle Status: Active; Minimum Order: 1; Mounting Type: Surface Mount; Operating Temperature: -65°C ~ 150°C; Package / Case: SOD-123; Packaging: TapeAndReel; PartId: 1896; Part Status: Active; Power - Max: 500mW; Price: 0.04; Series: -; Supplier 1: DigiKey; Supplier Part Number 1: MMSZ5246B-FDICT-ND; Supplier Device Package: SOD-123
D11 = MM5Z5V6ST1G: DIODE ZENER 5.61V 500MW SOD523; Manufacturer: ON Semiconductor; Current - Reverse Leakage @ Vr: 1µA @ 2V; Impedance (Max) (Zzt): 40 Ohms; Tolerance: ±2%; Voltage - Forward (Vf) (Max) @ If: 900mV @ 10mA; Part Number: MM5Z5V6ST1G; ComponentLink1Description: Datasheet; ComponentLink1URL: https://www.onsemi.com/pub/Collateral/MM5Z2V4ST1-D.PDF; ComponentLink2Description: DigiKey Link; ComponentLink2URL: http://digikey.com/product-detail/en/on-semiconductor/MM5Z5V6ST1G/MM5Z5V6ST1GOSCT-ND/964551; LastUpdated: 9/2/2020 1:19:35 AM; Lifecycle Status: Active; Minimum Order: 1; Mounting Type: Surface Mount; Operating Temperature: -65°C ~ 150°C; Package / Case: SC-79, SOD-523; Packaging: TapeAndReel; PartId: 3287; Part Status: Active; Power - Max: 500mW; Price: 0.05; Series: Automotive, AEC-Q101; Supplier 1: DigiKey; Supplier Part Number 1: MM5Z5V6ST1GOSCT-ND; Supplier Device Package: SOD-523
D12 = 1N4148W-7-F: DIODE GEN PURP 100V 300MA SOD123; Manufacturer: Diodes Incorporated; Current - Average Rectified (Io): 300mA (DC); Current - Reverse Leakage @ Vr: 1µA @ 75V; Diode Type: Standard; Reverse Recovery Time (trr): 4ns; Speed: Small Signal =< 200mA (Io), Any Speed; Voltage - Forward (Vf) (Max) @ If: 1.25V @ 150mA; Part Number: 1N4148W-7-F; ComponentLink1Description: Datasheet; ComponentLink1URL: https://www.diodes.com/assets/Datasheets/ds30086.pdf; ComponentLink2Description: DigiKey Link; ComponentLink2URL: http://digikey.com/product-detail/en/diodes-incorporated/1N4148W-7-F/1N4148W-FDICT-ND/815280; LastUpdated: 9/2/2020 1:19:08 AM; Lifecycle Status: Active; Minimum Order: 1; Mounting Type: Surface Mount; Operating Temperature - Junction: -65°C ~ 150°C; Package / Case: SOD-123; Packaging: TapeAndReel; PartId: 1002; Part Status: Active; Price: 0.03; Series: -; Supplier 1: DigiKey; Supplier Part Number 1: 1N4148W-FDICT-ND; Supplier Device Package: SOD-123; Voltage - DC Reverse (Vr) (Max): 100V
D13 D15 D16 = BAT46W-7-F: DIODE SCHOTTKY 100V 150MA SOD123; Manufacturer: Diodes Incorporated; Current - Average Rectified (Io): 150mA (DC); Current - Reverse Leakage @ Vr: 2µA @ 75V; Speed: Small Signal =< 200mA (Io), Any Speed; Voltage - Forward (Vf) (Max) @ If: 450mV @ 10mA; Part Number: BAT46W-7-F; ComponentLink1Description: Datasheet; ComponentLink1URL: https://www.diodes.com/assets/Datasheets/ds30044.pdf; ComponentLink2Description: DigiKey Link; ComponentLink2URL: http://digikey.com/product-detail/en/diodes-incorporated/BAT46W-7-F/BAT46W-7FDICT-ND/2181054; Diode Type: Schottky; LastUpdated: 9/2/2020 1:19:08 AM; Lifecycle Status: Active; Minimum Order: 1; Mounting Type: Surface Mount; Operating Temperature - Junction: -55°C ~ 125°C; Package / Case: SOD-123; Packaging: TapeAndReel; PartId: 2210; Part Status: Active; Price: 0.07; Series: Automotive, AEC-Q101; Supplier 1: DigiKey; Supplier Part Number 1: BAT46W-7FDICT-ND; Supplier Device Package: SOD-123; Voltage - DC Reverse (Vr) (Max): 100V
D14 = MMSZ5229BT1G: DIODE ZENER 4.3V 500MW SOD123; Manufacturer: ON Semiconductor; Current - Reverse Leakage @ Vr: 5µA @ 1V; Impedance (Max) (Zzt): 22 Ohms; Tolerance: ±5%; Voltage - Forward (Vf) (Max) @ If: 900mV @ 10mA; Part Number: MMSZ5229BT1G; ComponentLink1Description: Datasheet; ComponentLink1URL: http://www.onsemi.com/pub/Collateral/MMSZ5221BT1-D.PDF; ComponentLink2Description: DigiKey Link; ComponentLink2URL: http://digikey.com/product-detail/en/on-semiconductor/MMSZ5229BT1G/MMSZ5229BT1GOSCT-ND/1139889; LastUpdated: 9/2/2020 1:19:25 AM; Lifecycle Status: Active; Minimum Order: 1; Mounting Type: Surface Mount; Operating Temperature: -55°C ~ 150°C; Package / Case: SOD-123; Packaging: TapeAndReel; PartId: 2271; Part Status: Active; Power - Max: 500mW; Price: 0.04; Series: -; Supplier 1: DigiKey; Supplier Part Number 1: MMSZ5229BT1GOSCT-ND; Supplier Device Package: SOD-123
D17 = MMBZ5248BT-7-F: DIODE ZENER 18V 150MW SOT523; Manufacturer: Diodes Incorporated; Current - Reverse Leakage @ Vr: 100nA @ 14V; Impedance (Max) (Zzt): 21 Ohms; Tolerance: ±5%; Voltage - Forward (Vf) (Max) @ If: 900mV @ 10mA; Part Number: MMBZ5248BT-7-F; ComponentLink1Description: Datasheet; ComponentLink1URL: https://www.diodes.com/assets/Datasheets/ds30267.pdf; ComponentLink2Description: DigiKey Link; ComponentLink2URL: http://digikey.com/product-detail/en/diodes-incorporated/MMBZ5248BT-7-F/MMBZ5248BT-7-FDICT-ND/5218419; LastUpdated: 9/2/2020 1:21:31 AM; Lifecycle Status: Active; Minimum Order: 1; Mounting Type: Surface Mount; Operating Temperature: -65°C ~ 150°C; Package / Case: SOT-523; Packaging: CutTape; PartId: 789; Part Status: Active; Power - Max: 150mW; Price: 0.39; Series: -; Supplier 1: DigiKey; Supplier Part Number 1: MMBZ5248BT-7-FDICT-ND; Supplier Device Package: SOT-523
IC3 = 2N7002-7-F: MOSFET N-CH 60V 115MA SOT23-3; Manufacturer: Diodes Incorporated; Current - Continuous Drain (Id) @ 25°C: 115mA (Ta); Drive Voltage (Max Rds On,  Min Rds On): 5V, 10V; FET Type: N-Channel; Input Capacitance (Ciss) (Max) @ Vds: 50pF @ 25V; Power Dissipation (Max): 370mW (Ta); Rds On (Max) @ Id, Vgs: 7.5Ohm @ 50mA, 5V; Vgs (Max): ±20V; Vgs(th) (Max) @ Id: 2.5V @ 250µA; Part Number: 2N7002-7-F; ComponentLink1Description: Datasheet; ComponentLink1URL: https://www.diodes.com/assets/Datasheets/ds11303.pdf; ComponentLink2Description: DigiKey Link; ComponentLink2URL: http://digikey.com/product-detail/en/diodes-incorporated/2N7002-7-F/2N7002-FDICT-ND/717800; Drain to Source Voltage (Vdss): 60V; LastUpdated: 9/2/2020 1:25:03 AM; Lifecycle Status: Active; Minimum Order: 1; Mounting Type: Surface Mount; Operating Temperature: -55°C ~ 150°C (TJ); Package / Case: TO-236-3, SC-59, SOT-23-3; Packaging: TapeAndReel; Part Status: Active; Price: 0.03; Series: -; Supplier 1: DigiKey; Supplier Part Number 1: 2N7002-FDICT-ND; Supplier Device Package: SOT-23-3; Technology: MOSFET (Metal Oxide)
IC4 = BSS84-7-F: MOSFET P-CH 50V 130MA SOT23-3; Manufacturer: Diodes Incorporated; Current - Continuous Drain (Id) @ 25°C: 130mA (Ta); Drive Voltage (Max Rds On,  Min Rds On): 5V; FET Type: P-Channel; Input Capacitance (Ciss) (Max) @ Vds: 45pF @ 25V; Power Dissipation (Max): 300mW (Ta); Rds On (Max) @ Id, Vgs: 10Ohm @ 100mA, 5V; Vgs (Max): ±20V; Vgs(th) (Max) @ Id: 2V @ 1mA; Part Number: BSS84-7-F; ComponentLink1Description: Datasheet; ComponentLink1URL: https://www.diodes.com/assets/Datasheets/ds30149.pdf; ComponentLink2Description: DigiKey Link; ComponentLink2URL: http://digikey.com/product-detail/en/diodes-incorporated/BSS84-7-F/BSS84-FDICT-ND/717844; Drain to Source Voltage (Vdss): 50V; LastUpdated: 9/2/2020 1:25:04 AM; Lifecycle Status: Active; Minimum Order: 1; Mounting Type: Surface Mount; Operating Temperature: -55°C ~ 150°C (TJ); Package / Case: TO-236-3, SC-59, SOT-23-3; Packaging: TapeAndReel; Part Status: Active; Price: 0.03; Series: -; Supplier 1: DigiKey; Supplier Part Number 1: BSS84-FDICT-ND; Supplier Device Package: SOT-23-3; Technology: MOSFET (Metal Oxide)
IC5 = BSS123: as IC1 on sheet control_and_gauge; Part Number: BSS123; ComponentLink1Description: Datasheet; ComponentLink1URL: https://www.onsemi.com/pub/Collateral/BSS123-D.PDF; ComponentLink2Description: DigiKey Link; ComponentLink2URL: http://digikey.com/product-detail/en/on-semiconductor/BSS123/BSS123NCT-ND/244665; Drain to Source Voltage (Vdss): 100V; LastUpdated: 9/2/2020 1:25:08 AM; Lifecycle Status: Active; Minimum Order: 1; Mounting Type: Surface Mount; Operating Temperature: -55°C ~ 150°C (TJ); Package / Case: TO-236-3, SC-59, SOT-23-3; Packaging: TapeAndReel; Part Status: Active; Price: 0.06; Series: -; Supplier 1: DigiKey; Supplier Part Number 1: BSS123NCT-ND; Supplier Device Package: SOT-23-3; Technology: MOSFET (Metal Oxide)
R20-R23 = CRCW060310M0FKEA: RES SMD 10M OHM 1% 1/10W 0603; Manufacturer: Vishay Dale; Power (Watts): 0.1W, 1/10W; Temperature Coefficient: ±100ppm/°C; Part Number: CRCW060310M0FKEA; Value: 10 MOhms; ComponentLink1Description: Datasheet; ComponentLink1URL: http://www.vishay.com/docs/20035/dcrcwe3.pdf; ComponentLink2Description: DigiKey Link; ComponentLink2URL: http://digikey.com/product-detail/en/vishay-dale/CRCW060310M0FKEA/541-10.0MHCT-ND/1180266; Composition: Thick Film; Device Package: 0603 (1608 Metric); Features: Automotive AEC-Q200; Height - Seated (Max): 0.020" (0.50mm); LastUpdated: 9/2/2020 1:10:08 AM; Lifecycle Status: Active; Minimum Order: 1; Number of Terminations: 2; Operating Temperature: -55°C ~ 155°C; Package / Case: 0603 (1608 Metric); Packaging: CutTape; PartId: 12816; Part Status: Active; Price: 0.10; Ratings: AEC-Q200; Resistance: 10 MOhms; Series: CRCW; Size / Dimension: 0.061" L x 0.033" W (1.55mm x 0.85mm); Supplier 1: DigiKey; Supplier Part Number 1: 541-10.0MHCT-ND; Supplier Device Package: 0603; Tolerance: ±1%
R24 R30 R33 R34 R37 = CRCW0603100RFKTA: RES SMD 100 OHM 1% 1/10W 0603; Manufacturer: Vishay Dale; Power (Watts): 0.1W, 1/10W; Temperature Coefficient: ±100ppm/°C; Part Number: CRCW0603100RFKTA; Value: 100 Ohms; ComponentLink1Description: Datasheet; ComponentLink1URL: http://www.vishay.com/docs/20008/dcrcw.pdf; ComponentLink2Description: DigiKey Link; ComponentLink2URL: http://digikey.com/product-detail/en/vishay-dale/CRCW0603100RFKTA/541-2976-1-ND/6073619; Composition: Thick Film; Device Package: 0603 (1608 Metric); Features: Automotive AEC-Q200; Height - Seated (Max): 0.020" (0.50mm); LastUpdated: 9/2/2020 1:09:58 AM; Lifecycle Status: Active; Minimum Order: 1; Number of Terminations: 2; Operating Temperature: -55°C ~ 155°C; Package / Case: 0603 (1608 Metric); Packaging: TapeAndReel; PartId: 17521; Part Status: Active; Price: 0.01; Ratings: AEC-Q200; Resistance: 100 Ohms; Series: CRCW; Size / Dimension: 0.063" L x 0.033" W (1.60mm x 0.85mm); Supplier 1: DigiKey; Supplier Part Number 1: 541-2976-1-ND; Supplier Device Package: 0603; Tolerance: ±1%
R25 = CRCW060347R0FKEA: as R14 on sheet control_and_gauge; Part Number: CRCW060347R0FKEA; Value: 47 Ohms; ComponentLink1Description: Datasheet; ComponentLink1URL: http://www.vishay.com/docs/20035/dcrcwe3.pdf; ComponentLink2Description: DigiKey Link; ComponentLink2URL: http://digikey.com/product-detail/en/vishay-dale/CRCW060347R0FKEA/541-47.0HCT-ND/1179657; Composition: Thick Film; Device Package: 0603 (1608 Metric); Features: Automotive AEC-Q200; Height - Seated (Max): 0.020" (0.50mm); LastUpdated: 9/2/2020 1:10:02 AM; Lifecycle Status: Active; Minimum Order: 1; Number of Terminations: 2; Operating Temperature: -55°C ~ 155°C; Package / Case: 0603 (1608 Metric); Packaging: CutTape; PartId: 15336; Part Status: Active; Price: 0.10; Ratings: AEC-Q200; Resistance: 47 Ohms; Series: CRCW; Size / Dimension: 0.061" L x 0.033" W (1.55mm x 0.85mm); Supplier 1: DigiKey; Supplier Part Number 1: 541-47.0HCT-ND; Supplier Device Package: 0603; Tolerance: ±1%
R26 = CRCW0603200RFKEA: RES SMD 200 OHM 1% 1/10W 0603; Manufacturer: Vishay Dale; Power (Watts): 0.1W, 1/10W; Temperature Coefficient: ±100ppm/°C; Part Number: CRCW0603200RFKEA; Value: 200 Ohms; ComponentLink1Description: Datasheet; ComponentLink1URL: http://www.vishay.com/docs/20035/dcrcwe3.pdf; ComponentLink2Description: DigiKey Link; ComponentLink2URL: http://digikey.com/product-detail/en/vishay-dale/CRCW0603200RFKEA/541-200HCT-ND/1179727; Composition: Thick Film; Device Package: 0603 (1608 Metric); Features: Automotive AEC-Q200; Height - Seated (Max): 0.020" (0.50mm); LastUpdated: 9/2/2020 1:10:09 AM; Lifecycle Status: Active; Minimum Order: 1; Number of Terminations: 2; Operating Temperature: -55°C ~ 155°C; Package / Case: 0603 (1608 Metric); Packaging: CutTape; PartId: 12561; Part Status: Active; Price: 0.10; Ratings: AEC-Q200; Resistance: 200 Ohms; Series: CRCW; Size / Dimension: 0.061" L x 0.033" W (1.55mm x 0.85mm); Supplier 1: DigiKey; Supplier Part Number 1: 541-200HCT-ND; Supplier Device Package: 0603; Tolerance: ±1%
R27 R40 = CRCW06031M00FKEA: as R1 on sheet control_and_gauge; Part Number: CRCW06031M00FKEA; Value: 1 MOhms; ComponentLink1Description: Datasheet; ComponentLink1URL: http://www.vishay.com/docs/20035/dcrcwe3.pdf; ComponentLink2Description: DigiKey Link; ComponentLink2URL: http://digikey.com/product-detail/en/vishay-dale/CRCW06031M00FKEA/541-1.00MHCT-ND/1180152; Composition: Thick Film; Device Package: 0603 (1608 Metric); Features: Automotive AEC-Q200; Height - Seated (Max): 0.020" (0.50mm); LastUpdated: 9/2/2020 1:10:09 AM; Lifecycle Status: Active; Minimum Order: 1; Number of Terminations: 2; Operating Temperature: -55°C ~ 155°C; Package / Case: 0603 (1608 Metric); Packaging: CutTape; PartId: 12567; Part Status: Active; Price: 0.10; Ratings: AEC-Q200; Resistance: 1 MOhms; Series: CRCW; Size / Dimension: 0.061" L x 0.033" W (1.55mm x 0.85mm); Supplier 1: DigiKey; Supplier Part Number 1: 541-1.00MHCT-ND; Supplier Device Package: 0603; Tolerance: ±1%
R28 R29 R32 R35 = CRCW06031K00FKEA: RES SMD 1K OHM 1% 1/10W 0603; Manufacturer: Vishay Dale; Power (Watts): 0.1W, 1/10W; Temperature Coefficient: ±100ppm/°C; Part Number: CRCW06031K00FKEA; Value: 1 kOhms; ComponentLink1Description: Datasheet; ComponentLink1URL: http://www.vishay.com/docs/20035/dcrcwe3.pdf; ComponentLink2Description: DigiKey Link; ComponentLink2URL: http://digikey.com/product-detail/en/vishay-dale/CRCW06031K00FKEA/541-1.00KHCT-ND/1179809; Composition: Thick Film; Device Package: 0603 (1608 Metric); Features: Automotive AEC-Q200; Height - Seated (Max): 0.020" (0.50mm); LastUpdated: 9/2/2020 1:09:36 AM; Lifecycle Status: Active; Minimum Order: 1; Number of Terminations: 2; Operating Temperature: -55°C ~ 155°C; Package / Case: 0603 (1608 Metric); Packaging: CutTape; PartId: 24637; Part Status: Active; Price: 0.10; Ratings: AEC-Q200; Resistance: 1 kOhms; Series: CRCW; Size / Dimension: 0.061" L x 0.033" W (1.55mm x 0.85mm); Supplier 1: DigiKey; Supplier Part Number 1: 541-1.00KHCT-ND; Supplier Device Package: 0603; Tolerance: ±1%
R31 = CRCW0603510RFKEA: as R15 on sheet control_and_gauge; Part Number: CRCW0603510RFKEA; Value: 510 Ohms; ComponentLink1Description: Datasheet; ComponentLink1URL: http://www.vishay.com/docs/20035/dcrcwe3.pdf; ComponentLink2Description: DigiKey Link; ComponentLink2URL: http://digikey.com/product-detail/en/vishay-dale/CRCW0603510RFKEA/541-510HCT-ND/1179775; Composition: Thick Film; Device Package: 0603 (1608 Metric); Features: Automotive AEC-Q200; Height - Seated (Max): 0.020" (0.50mm); LastUpdated: 9/2/2020 1:10:08 AM; Lifecycle Status: Active; Minimum Order: 1; Number of Terminations: 2; Operating Temperature: -55°C ~ 155°C; Package / Case: 0603 (1608 Metric); Packaging: CutTape; PartId: 12640; Part Status: Active; Price: 0.10; Ratings: AEC-Q200; Resistance: 510 Ohms; Series: CRCW; Size / Dimension: 0.061" L x 0.033" W (1.55mm x 0.85mm); Supplier 1: DigiKey; Supplier Part Number 1: 541-510HCT-ND; Supplier Device Package: 0603; Tolerance: ±1%
R36 = RC0603FR-07665KL: RES SMD 665K OHM 1% 1/10W 0603; Manufacturer: Yageo; Power (Watts): 0.1W, 1/10W; Temperature Coefficient: ±100ppm/°C; Part Number: RC0603FR-07665KL; Value: 665 kOhms; ComponentLink1Description: Datasheet; ComponentLink1URL: https://www.yageo.com/upload/media/product/productsearch/datasheet/rchip/PYu-RC_Group_51_RoHS_L_10.pdf; ComponentLink2Description: DigiKey Link; ComponentLink2URL: http://digikey.com/product-detail/en/yageo/RC0603FR-07665KL/311-665KHRCT-ND/730297; Composition: Thick Film; Device Package: 0603 (1608 Metric); Features: Moisture Resistant; Height - Seated (Max): 0.022" (0.55mm); LastUpdated: 9/2/2020 1:09:44 AM; Lifecycle Status: Active; Minimum Order: 1; Number of Terminations: 2; Operating Temperature: -55°C ~ 155°C; Package / Case: 0603 (1608 Metric); Packaging: CutTape; PartId: 22846; Part Status: Active; Price: 0.10; Resistance: 665 kOhms; Series: RC; Size / Dimension: 0.063" L x 0.031" W (1.60mm x 0.80mm); Supplier 1: DigiKey; Supplier Part Number 1: 311-665KHRCT-ND; Supplier Device Package: 0603; Tolerance: ±1%
R38 = CRCW060316K5FKEA: as R8 on sheet control_and_gauge; Part Number: CRCW060316K5FKEA; Value: 16.5 kOhms; ComponentLink1Description: Datasheet; ComponentLink1URL: http://www.vishay.com/docs/20035/dcrcwe3.pdf; ComponentLink2Description: DigiKey Link; ComponentLink2URL: http://digikey.com/product-detail/en/vishay-dale/CRCW060316K5FKEA/541-16.5KHCT-ND/1179947; Composition: Thick Film; Device Package: 0603 (1608 Metric); Features: Automotive AEC-Q200; Height - Seated (Max): 0.020" (0.50mm); LastUpdated: 9/2/2020 1:09:44 AM; Lifecycle Status: Active; Minimum Order: 1; Number of Terminations: 2; Operating Temperature: -55°C ~ 155°C; Package / Case: 0603 (1608 Metric); Packaging: CutTape; PartId: 22960; Part Status: Active; Price: 0.10; Ratings: AEC-Q200; Resistance: 16.5 kOhms; Series: CRCW; Size / Dimension: 0.061" L x 0.033" W (1.55mm x 0.85mm); Supplier 1: DigiKey; Supplier Part Number 1: 541-16.5KHCT-ND; Supplier Device Package: 0603; Tolerance: ±1%
R39 = CRCW06033M30FKEA: as R2 on sheet control_and_gauge; Part Number: CRCW06033M30FKEA; Value: 3.3 MOhms; ComponentLink1Description: Datasheet; ComponentLink1URL: http://www.vishay.com/docs/20035/dcrcwe3.pdf; ComponentLink2Description: DigiKey Link; ComponentLink2URL: http://digikey.com/product-detail/en/vishay-dale/CRCW06033M30FKEA/541-3.30MHCT-ND/1180209; Composition: Thick Film; Device Package: 0603 (1608 Metric); Features: Automotive AEC-Q200; Height - Seated (Max): 0.020" (0.50mm); LastUpdated: 9/2/2020 1:09:32 AM; Lifecycle Status: Active; Minimum Order: 1; Number of Terminations: 2; Operating Temperature: -55°C ~ 155°C; Package / Case: 0603 (1608 Metric); Packaging: CutTape; PartId: 25411; Part Status: Active; Price: 0.10; Ratings: AEC-Q200; Resistance: 3.3 MOhms; Series: CRCW; Size / Dimension: 0.061" L x 0.033" W (1.55mm x 0.85mm); Supplier 1: DigiKey; Supplier Part Number 1: 541-3.30MHCT-ND; Supplier Device Package: 0603; Tolerance: ±1%
U6 = BQ76200PWR: Battery Battery Protection IC Multi-Chemistry 16-TSSOP; Manufacturer: Texas Instruments; PIN_COUNT: 16; Output Voltage: 14V; Operating Supply Voltage: 75V; Application_BuildNumber: *; PartNumber: BQ76200PWR; Alternate_PartNumber: BQ76200PW; PackageReference: PW0016A; MountType: SMT; CompType: IC; RoHS: Y; RefDes: RefDes; Type: DEV; Value: Value; Copyright: Copyright (C) 2018 Accelerated Designs. All rights reserved; Supplier 1: Digi-Key; Manufacturer Part Number: BQ76200PWR; Stock 1: 7339; Pricing 1: 1=2.34, 10=2.099, 25=1.98, 100=1.584, 250=1.386, 500=1.3464, 1000=1.0692 (USD); Mount: Surface Mount; Case/Package: TSSOP; Number of Pins: 16; Contact Plating: Gold; Min Operating Temperature: -40°C; Max Operating Temperature: 85°C; Packaging: Tape and Reel; Lead Free: Lead Free; ComponentLink1URL: http://www.ti.com/lit/ds/symlink/bq76200.pdf?src-supplier=Digi-Key; ComponentLink1Description: http://www.ti.com/lit/ds/symlink/bq76200.pdf?src-supplier=Digi-Key; ComponentLink2URL: http://www.ti.com/lit/gpn/bq76200?src-supplier=Mouser; ComponentLink2Description: http://www.ti.com/lit/gpn/bq76200?src-supplier=Mouser; Supplier Part Number 1: 296-43273-6-ND